# EAGLE schematic Power Switch (EAGLE 8.2.1)
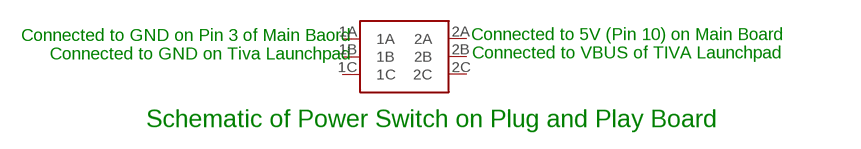
[diagram p0: schematic, sheet 1]

## Parts
U$3  SELF-LOCKING_SWITCHSELF-LOCKING_SWITCH  [SELF-LOCKING_SWITCH]
Unconnected: U$3.1A U$3.1B U$3.1C U$3.2A U$3.2B U$3.2C

## Notes on the sheet
- Connected to GND on Pin 3 of Main Baord | Connected to 5V (Pin 10) on Main Board
- Connected to GND on Tiva Launchpad | Connected to VBUS of TIVA Launchpad
- Schematic of Power Switch on Plug and Play Board

## Library data of the parts
U$3 = Switch_Self-locking:SELF-LOCKING_SWITCH